# Altium schematic sheet AIO-RF-v2-Sheet2.SchDoc
size A; SheetNumber: 2; SheetTotal: 2
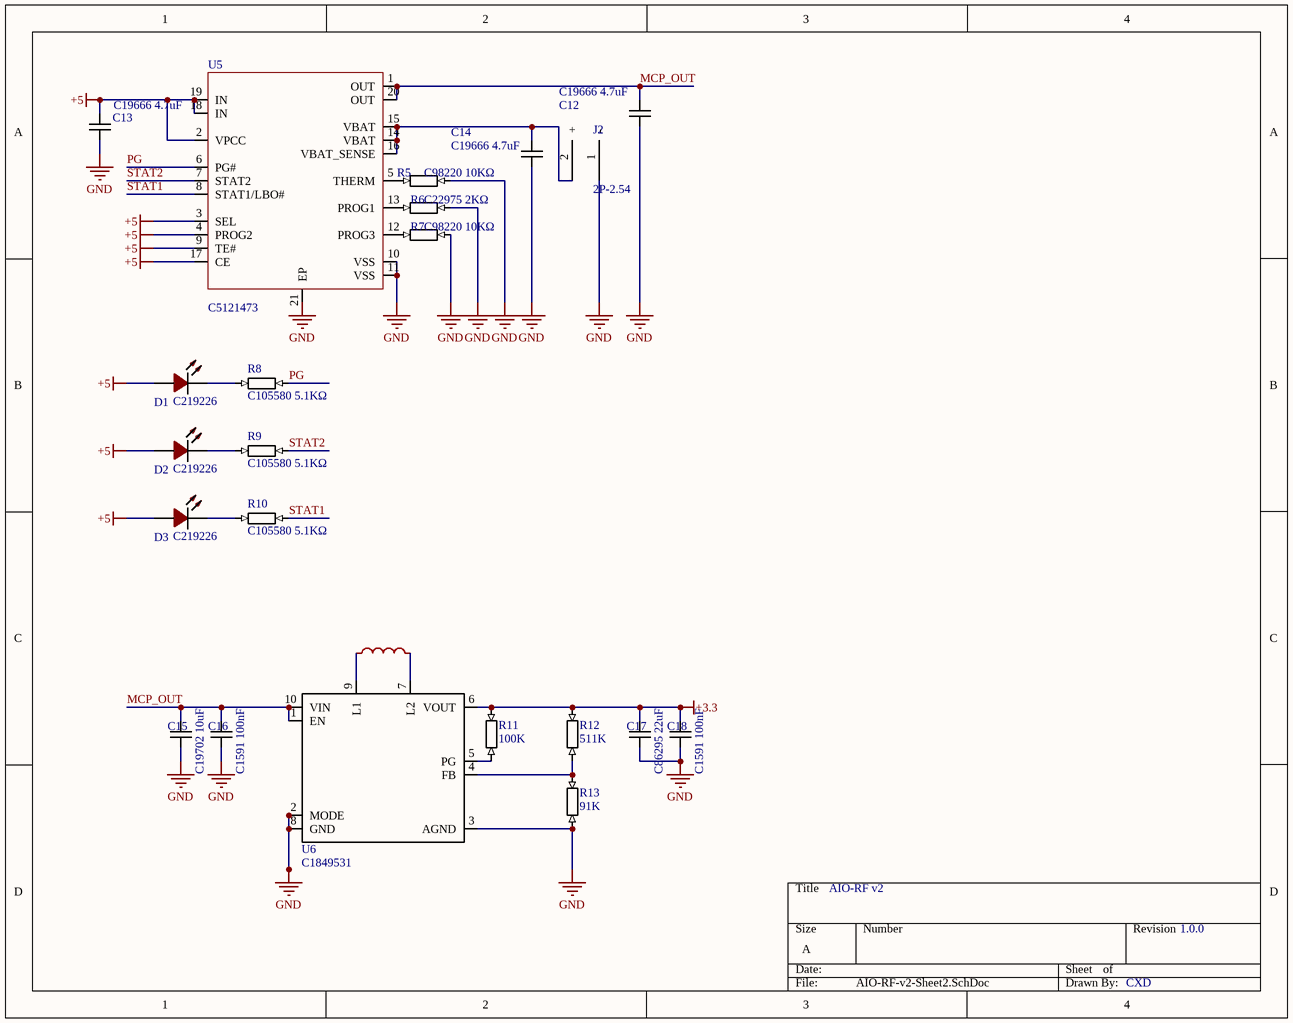
[diagram p0: AIO-RF-v2-Sheet2.SchDoc]

## Parts
C12  C19666 4.7uF  [C19666]
C13  C19666 4.7uF  [C19666]
C14  C19666 4.7uF  [C19666]
C15  C19702 10uF  [C19702]
C16  C1591 100nF  [C1591]
C17  C86295 22uF  [C86295]
C18  C1591 100nF  [C1591]
D1  C219226  [C219226]
D2  C219226  [C219226]
D3  C219226  [C219226]
J2  2P-2.54  [2P-2.54]
L1  hctc-201610-1r0-m  [Inductor]  (value not drawn)
R5  C98220 10KΩ  [C98220]
R6  C22975 2KΩ  [C22975]
R7  C98220 10KΩ  [C98220]
R8  C105580 5.1KΩ  [C105580]
R9  C105580 5.1KΩ  [C105580]
R10  C105580 5.1KΩ  [C105580]
R11  100K  [C22975]
R12  511K  [C22975]
R13  91K  [C22975]
U5  C5121473  [C5121473]
U6  C1849531  [C1849531]

## Nets
+3.3: C17.2 C18.2 R11.2 R12.2 U6.6(VOUT)
+5: C13.2 D1.2(A) D2.2(A) D3.2(A) U5.2(VPCC) U5.3(SEL) U5.4(PROG2) U5.9(TE#) U5.17(CE) U5.18(IN) U5.19(IN)
GND: C12.1 C13.1 C14.1 C15.1 C16.1 C17.1 C18.1 J2.1(-) R5.1 R6.2 R7.1 R13.1 U5.10(VSS) U5.11(VSS) U5.21(EP) U6.2(MODE) U6.3(AGND) U6.8(GND)
MCP_OUT: C12.2 C15.2 C16.2 U5.1(OUT) U5.20(OUT) U6.1(EN) U6.10(VIN)
PG: R8.1 U5.6(PG#)
STAT1: R10.1 U5.8(STAT1/LBO#)
STAT2: R9.1 U5.7(STAT2)
NetC14_2: C14.2 J2.2(+) U5.14(VBAT) U5.15(VBAT) U5.16(VBAT_SENSE)
NetD1_1: D1.1(C) R8.2
NetD2_1: D2.1(C) R9.2
NetD3_1: D3.1(C) R10.2
NetL1_1: L1.1 U6.9(L1)
NetL1_2: L1.2 U6.7(L2)
NetR5_2: R5.2 U5.5(THERM)
NetR6_1: R6.1 U5.13(PROG1)
NetR7_2: R7.2 U5.12(PROG3)
NetR11_1: R11.1 U6.5(PG)
NetR12_1: R12.1 R13.2 U6.4(FB)

## Notes on the sheet
- AIO-RF v2
- 1.0.0
- CXD

## Library data of the parts
C12-C14 = C19666: 4.7uF (475) ±10% 16V; Manufacturer: SAMSUNG(三星); Manufacturer Part Number: CL10A475KO8NNNC; LCSC Part Number: C19666; Supplier: LCSC; Supplier Part Number: C19666; Imported By: JLCAltiumImporter 0.3.1; Package: C0603
C15 = C19702: Manufacturer: SAMSUNG(三星); Manufacturer Part Number: CL10A106KP8NNNC; LCSC Part Number: C19702; Supplier: LCSC; Supplier Part Number: C19702; Imported By: JLCAltiumImporter 0.3.1; Package: C0603
C16 C18 = C1591: 100nF (104) ±10% 50V; Manufacturer: SAMSUNG(三星); Manufacturer Part Number: CL10B104KB8NNNC; LCSC Part Number: C1591; Supplier: LCSC; Supplier Part Number: C1591; Imported By: JLCAltiumImporter 0.3.1; Package: C0603
C17 = C86295: Manufacturer: SAMSUNG(三星); Manufacturer Part Number: CL10A226MP8NUNE; LCSC Part Number: C86295; Supplier: LCSC; Supplier Part Number: C86295; Imported By: JLCAltiumImporter 0.3.1; Package: C0603
D1-D3 = C219226: Manufacturer: HONGLITRONIC(鸿利光电); Manufacturer Part Number: HL-PST-1608H233W(9000-16000K); LCSC Part Number: C219226; Supplier: LCSC; Supplier Part Number: C219226; Imported By: JLCAltiumImporter 0.3.2; Package: LED0603-RD
L1 = hctc-201610-1r0-m: Manufacturer: YOUCHI(佑驰); AddInBom: yes; ModelId: 354c7c64a6c14853a17e163bf9c9633c; ModelName: IND-SMD_L2.0-W1.6_MTQH201610S; ModelTransform: 78.74,63.3857,0,0,0,0,0,0,0; Symbol: HCTC-201610-1R0-M; LCSC Part Name: 1uH ±20% 4.6A; SupplierPart: C49190099; ManufacturerPart: HCTC-201610-1R0-M; Supplier Footprint: 0806; JLCPCB Part Class: Extended Part; Datasheet: https://item.szlcsc.com/datasheet/HCTC-201610-1R0-M/51586942.html; Supplier: LCSC; ConvertToPcb: yes; FootprintName: IND-SMD_L2.0-W1.6_MTQH201610S
R5 R7 = C98220: Manufacturer: YAGEO(国巨); Manufacturer Part Number: RC0603FR-0710KL; LCSC Part Number: C98220; Supplier: LCSC; Supplier Part Number: C98220; Imported By: JLCAltiumImporter 0.3.1; Package: R0603
R6 R11-R13 = C22975: 2KΩ (2001) ±1%; Manufacturer: UNI-ROYAL(厚声); Manufacturer Part Number: 0603WAF2001T5E; LCSC Part Number: C22975; Supplier: LCSC; Supplier Part Number: C22975; Imported By: JLCAltiumImporter 0.3.1; Package: R0603
R8-R10 = C105580: Manufacturer: YAGEO(国巨); Manufacturer Part Number: RC0603FR-075K1L; Supplier: LCSC; Supplier Part Number: C105580; Imported By: JLCAltiumImporter 0.3.1; Package: R0603; LCSC Part Number: C105580
U5 = C5121473: Manufacturer: MICROCHIP(美国微芯); Manufacturer Part Number: MCP73871-2CCI/ML; LCSC Part Number: C5121473; Supplier: LCSC; Supplier Part Number: C5121473; Imported By: JLCAltiumImporter 0.3.1; Package: QFN-20_L4.0-W4.0-P0.50-BL-EP2.7
U6 = C1849531: Manufacturer: TI(德州仪器); Manufacturer Part Number: TPS63802DLAT; LCSC Part Number: C1849531; Supplier: LCSC; Supplier Part Number: C1849531; Imported By: JLCAltiumImporter 0.3.5; Package: VSON-10-HR_L3.0-W2.0-P0.50-BL_TI_DLA